# Altium schematic sheet ZIF_HIZ_and_Conververter.SchDoc
size 431 x 279 mm; Organization: ORGANIZATION; Address1: ADDRESS 1; Address2: ADDRESS 2; Address3: ADDRESS 3; Address4: ADDRESS 4; Revision: -; SheetNumber: 6; SheetTotal: 6; ENG_APP_DATE: --/--/--; DSN_APP_DATE: --/--/--; CHK_APP_DATE: --/--/--
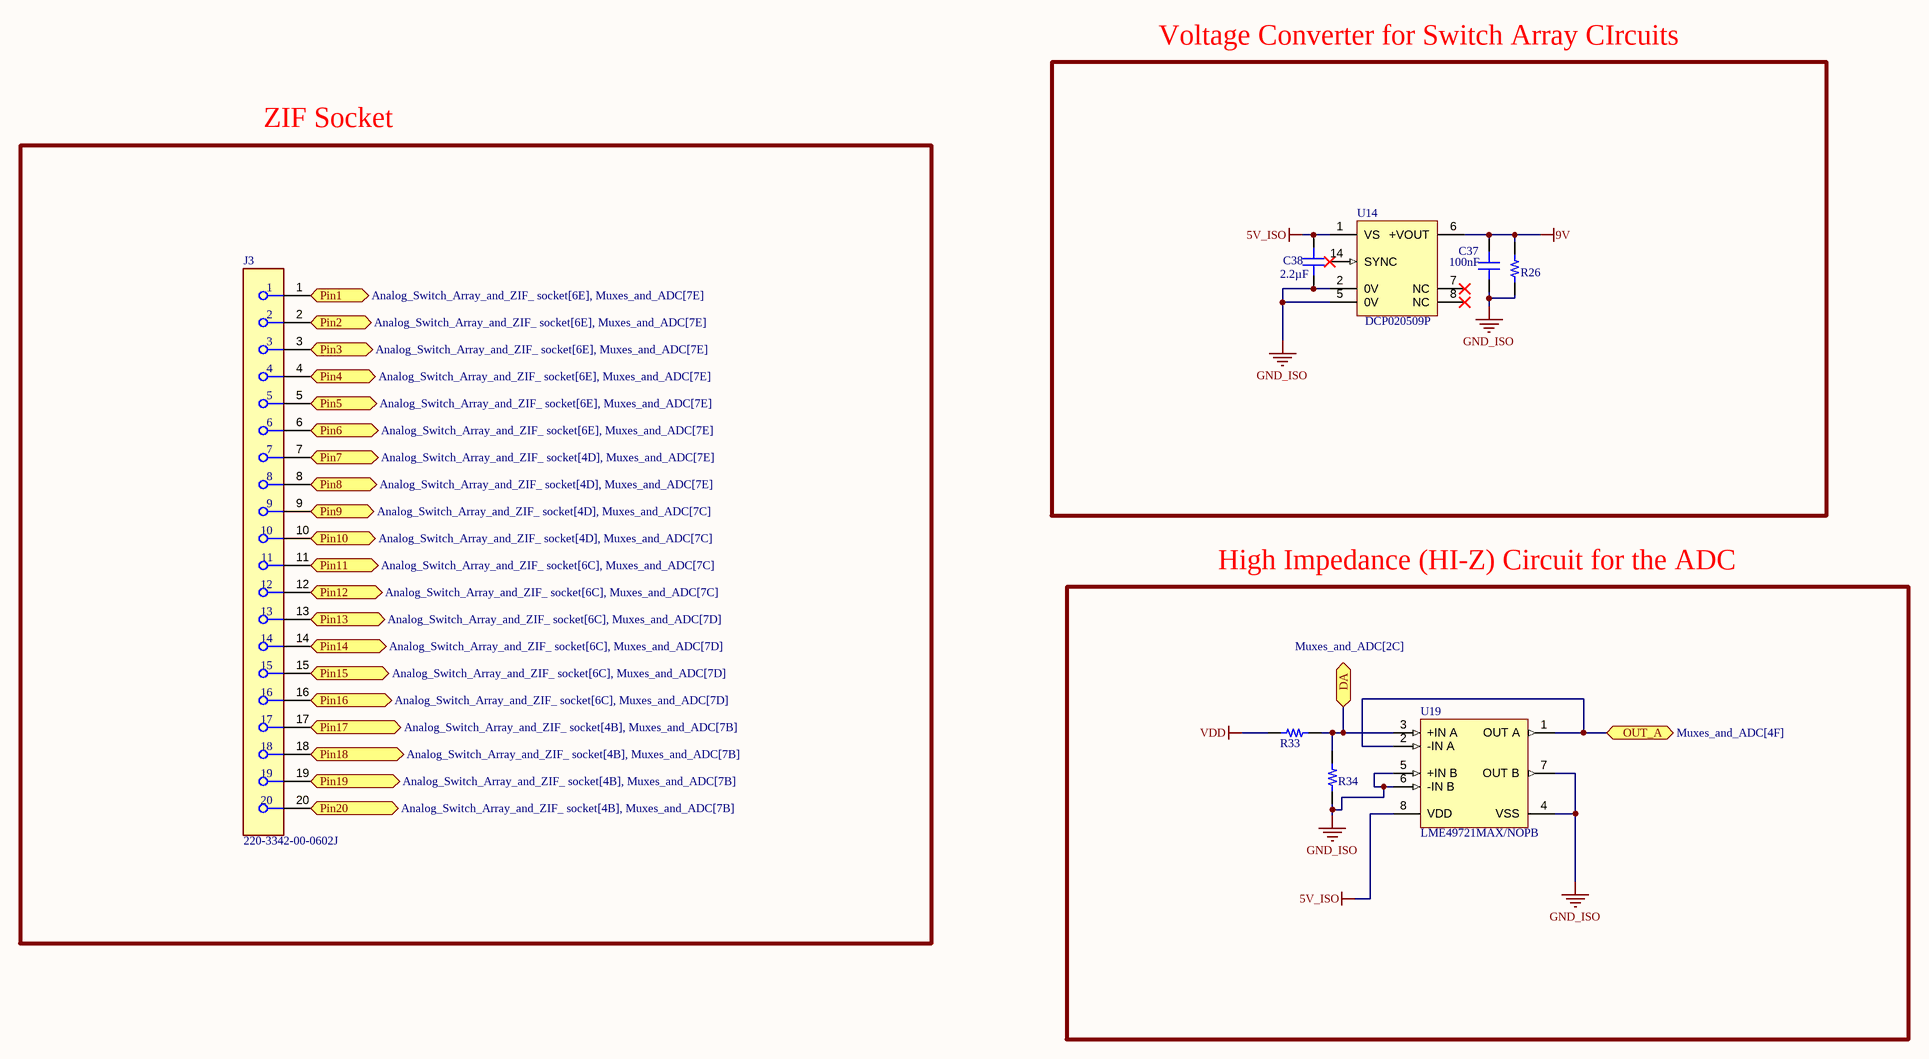
[diagram p0: ZIF_HIZ_and_Conververter.SchDoc]

## Parts
C37  value 100nF  [CAP 1206_3216 - 0.8MM]  (hidden comment: C1206X104G4HAC7800)
C38  value 2.2µF  [CAP 1206_3216 - 0.8MM]  (hidden comment: CC1206ZRY5V8BB225)
J3  220-3342-00-0602J  [FP-220-3342-00-0602J-0]
R26  RT1206BRD07125RL  [YAGEO RES 1206_3216]  (value not drawn)
R33  TNPW1206100KBEEA  [RES 1206_3216]  (value not drawn)
R34  TNPW1206100KBEEA  [RES 1206_3216]  (value not drawn)
U14  DCP020509P  [NVA0007A]
U19  LME49721MAX/NOPB  [D0008A_L]

## Blocks framed on the sheet
Voltage Converter for Switch Array CIrcuits: C37 C38 R26 U14
ZIF Socket: J3
High Impedance (HI-Z) Circuit for the ADC: R33 R34 U19

## Ports
DA (bidir, see Muxes_and_ADC[2C]), OUT_A (bidir, see Muxes_and_ADC[4F]), Pin1 (bidir, see Analog_Switch_Array_and_ZIF_ socket[6E], Muxes_and_ADC[7E]), Pin2 (bidir, see Analog_Switch_Array_and_ZIF_ socket[6E], Muxes_and_ADC[7E]), Pin3 (bidir, see Analog_Switch_Array_and_ZIF_ socket[6E], Muxes_and_ADC[7E]), Pin4 (bidir, see Analog_Switch_Array_and_ZIF_ socket[6E], Muxes_and_ADC[7E]), Pin5 (bidir, see Analog_Switch_Array_and_ZIF_ socket[6E], Muxes_and_ADC[7E]), Pin6 (bidir, see Analog_Switch_Array_and_ZIF_ socket[6E], Muxes_and_ADC[7E]), Pin7 (bidir, see Analog_Switch_Array_and_ZIF_ socket[4D], Muxes_and_ADC[7E]), Pin8 (bidir, see Analog_Switch_Array_and_ZIF_ socket[4D], Muxes_and_ADC[7E]), Pin9 (bidir, see Analog_Switch_Array_and_ZIF_ socket[4D], Muxes_and_ADC[7C]), Pin10 (bidir, see Analog_Switch_Array_and_ZIF_ socket[4D], Muxes_and_ADC[7C]), Pin11 (bidir, see Analog_Switch_Array_and_ZIF_ socket[6C], Muxes_and_ADC[7C]), Pin12 (bidir, see Analog_Switch_Array_and_ZIF_ socket[6C], Muxes_and_ADC[7C]), Pin13 (bidir, see Analog_Switch_Array_and_ZIF_ socket[6C], Muxes_and_ADC[7D]), Pin14 (bidir, see Analog_Switch_Array_and_ZIF_ socket[6C], Muxes_and_ADC[7D]), Pin15 (bidir, see Analog_Switch_Array_and_ZIF_ socket[6C], Muxes_and_ADC[7D]), Pin16 (bidir, see Analog_Switch_Array_and_ZIF_ socket[6C], Muxes_and_ADC[7D]), Pin17 (bidir, see Analog_Switch_Array_and_ZIF_ socket[4B], Muxes_and_ADC[7B]), Pin18 (bidir, see Analog_Switch_Array_and_ZIF_ socket[4B], Muxes_and_ADC[7B]), Pin19 (bidir, see Analog_Switch_Array_and_ZIF_ socket[4B], Muxes_and_ADC[7B]), Pin20 (bidir, see Analog_Switch_Array_and_ZIF_ socket[4B], Muxes_and_ADC[7B])

## Nets
5V_ISO: C38.2 U14.1(VS) U19.8(VDD)
9V: C37.2 R26.2 U14.6(+VOUT)
GND_ISO: C37.1 C38.1 R26.1 R34.1 U14.2(0V) U14.5(0V) U19.4(VSS) U19.5(+IN_B) U19.6(-IN_B) U19.7(OUT_B)
VDD: R33.1
DA: R33.2 R34.2 U19.3(+IN_A) ; port DA
OUT_A: U19.1(OUT_A) U19.2(-IN_A) ; port OUT_A
Pin1: J3.1 ; port Pin1
Pin2: J3.2 ; port Pin2
Pin3: J3.3 ; port Pin3
Pin4: J3.4 ; port Pin4
Pin5: J3.5 ; port Pin5
Pin6: J3.6 ; port Pin6
Pin7: J3.7 ; port Pin7
Pin8: J3.8 ; port Pin8
Pin9: J3.9 ; port Pin9
Pin10: J3.10 ; port Pin10
Pin11: J3.11 ; port Pin11
Pin12: J3.12 ; port Pin12
Pin13: J3.13 ; port Pin13
Pin14: J3.14 ; port Pin14
Pin15: J3.15 ; port Pin15
Pin16: J3.16 ; port Pin16
Pin17: J3.17 ; port Pin17
Pin18: J3.18 ; port Pin18
Pin19: J3.19 ; port Pin19
Pin20: J3.20 ; port Pin20

Not connected (* = marked no-connect by the designer): U14 7(NC)* 8(NC)* 14(SYNC)*

## Notes on the sheet
- DWG. NO.
- REV.
- SHT.
- THIS DOCUMENT AND THE DATA DISCLOSED HEREIN OR HEREWITH IS THE PROPERTY OF ALTIUM LIMITED AND MAY BE FREELY DISTRIBUTED IN WHOLE. NO RIGHTS ARE RESERVED OR EXPRESS OR IMPLIED WARANTEE GIVEN.
- REVISION
- DESCRIPTION
- DATE
- APPROVED
- ENG:
- APPROVALS
- PROJECT
- DSN:
- CHK:
- REFERENCE DOCUMENTS
- PROJECT REVISION:
- TITLE
- DOCUMENT REVISION:
- DESIGN ITEM:
- BOM:
- FAB DWG:
- PCB DWG:
- ASSY DWG:
- SCALE:
- SIZE
- B
- CAGE CODE
- FILE NAME
- DWG NO.
- SHEET
- OF
- REV

## Library data of the parts
C37 = CMP-001-063573-1: CAP CER 1206 0.1F 16V ULTRA STAB; Part Number: C1206X104G4HAC7800
C38 = CMP-001-058176-1: CAP CER 2.2UF 25V Y5V 1206; Part Number: CC1206ZRY5V8BB225
J3 = CMP-05380-000001-1: CONN IC DIP SOCKET ZIF 20POS GLD; Manufacturer: 3M; Is Female: yes; Standoff Height: 0.38mm; Conn Orientation: Vertical; Number Of Contacts: 20; Conn Gender: Female; Socket Package: DIP20; Pitch: 2.54mm; Current Rating: 1A; Category: Conn; Temperature Range Low: -55°C; Package: 0; Device Class L3: unset; Temperature: -55°C to +125°C; Number Of Rows: 2; ComponentLink2Description: Datasheet; ComponentLink2URL: https://multimedia.3m.com/mws/media/494546O/3mtm-dip-sockets-100-2-54-mm-ts0365.pdf; Temperature Range High: +125°C; Digikey Description: CONN IC DIP SOCKET ZIF 20POS GLD; Mouser Description: IC & Component Sockets 0.100 DIP SOCKET 20 Contact Qty.; Manufacturer Part Number: 220-3342-00-0602J; Device Class L2: IC and Component Sockets; Octopart: https://octopart.com/220-3342-00-0602j-3m-108647; Device Class L1: Connectors; Contact Material: Gold,Nickel; Height: 24mm; Lead Free: Yes; RoHS: TRUE; Automotive: No
R26 = CMP-009-090155-1: RES SMD 125 OHM 0.1% 1/4W 1206; Part Number: RT1206BRD07125RL
R33 R34 = CMP-009-076876-1: RES 100K OHM 0.1% 1/4W 1206; Part Number: TNPW1206100KBEEA
U14 = CMP-0387-00789-2: Miniature, 2 W Isolated Unregulated DC-DC Converter, -40 to 85 degC, 7-pin DIP (NVA7), Pb-Free (RoHS); Manufacturer: Texas Instruments; SubFamily: 1 W & 2 W Miniature; Vout(Min)(V): 8.55; Iout(Max)(A): 0.222; Vout(Max)(V): 9.45; Vin(Min)(V): 4.5; Regulated Outputs(#): 1; Vin(Max)(V): 5.5; ComponentLink1URL: http://www.ti.com/; Eco-Plan: Pb-Free (RoHS); PackageDescription: 7-Pin Plastic In-Line, Body 6.61 x 19.18 mm; ComponentLink2URL: http://www.ti.com/general/docs/lit/getliterature.tsp?genericPartNumber=DCP020509&fileType=pdf; PackageReference: NVA0007A; DatasheetVersion: SBVS011K; Mounting Technology: Through Hole; ComponentLink4Description: URL Link1; ComponentLink3Description: Package Specification; PartNumber: DCP020509P; Code_JEDEC: MS-001-AA; PackageVersion: 4202489/B; ComponentLink4URL: Samples URL:http://www.ti.com/product/dcp020509#samples; ComponentLink1Description: Manufacturer URL; ComponentLink3URL: http://www.ti.com/lit/ml/mpdi058a/mpdi058a.pdf; ComponentLink2Description: Datasheet
U19 = CMP-0057-00384-3: High Performance, High Fidelity Rail-to-Rail Input/Output Audio Operational Amplifier, 8-pin Narrow SOIC, Pb-Free; Manufacturer: Texas Instruments; PowerWise: N; CompType: Audio IC; PackageTopMarking: NSZXTT*L49721*MA; ComponentLink1URL: http://www.ti.com/general/docs/lit/getliterature.tsp?genericPartNumber=LME49721&fileType=pdf; PackageReference: D0008A; RoHS: Y; ComponentLink1Description: Datasheet URL; Code_IPC: SOIC127P600-8; Code_JEDEC: MS-012-AA; PinCount: 8; PackageDescription: SOIC Narrow, 4.9 x 3.9 x 1.45mm, 8 Lead, 1.27mm Pitch